# Altium project Data-Logging-Module.PrjPcb
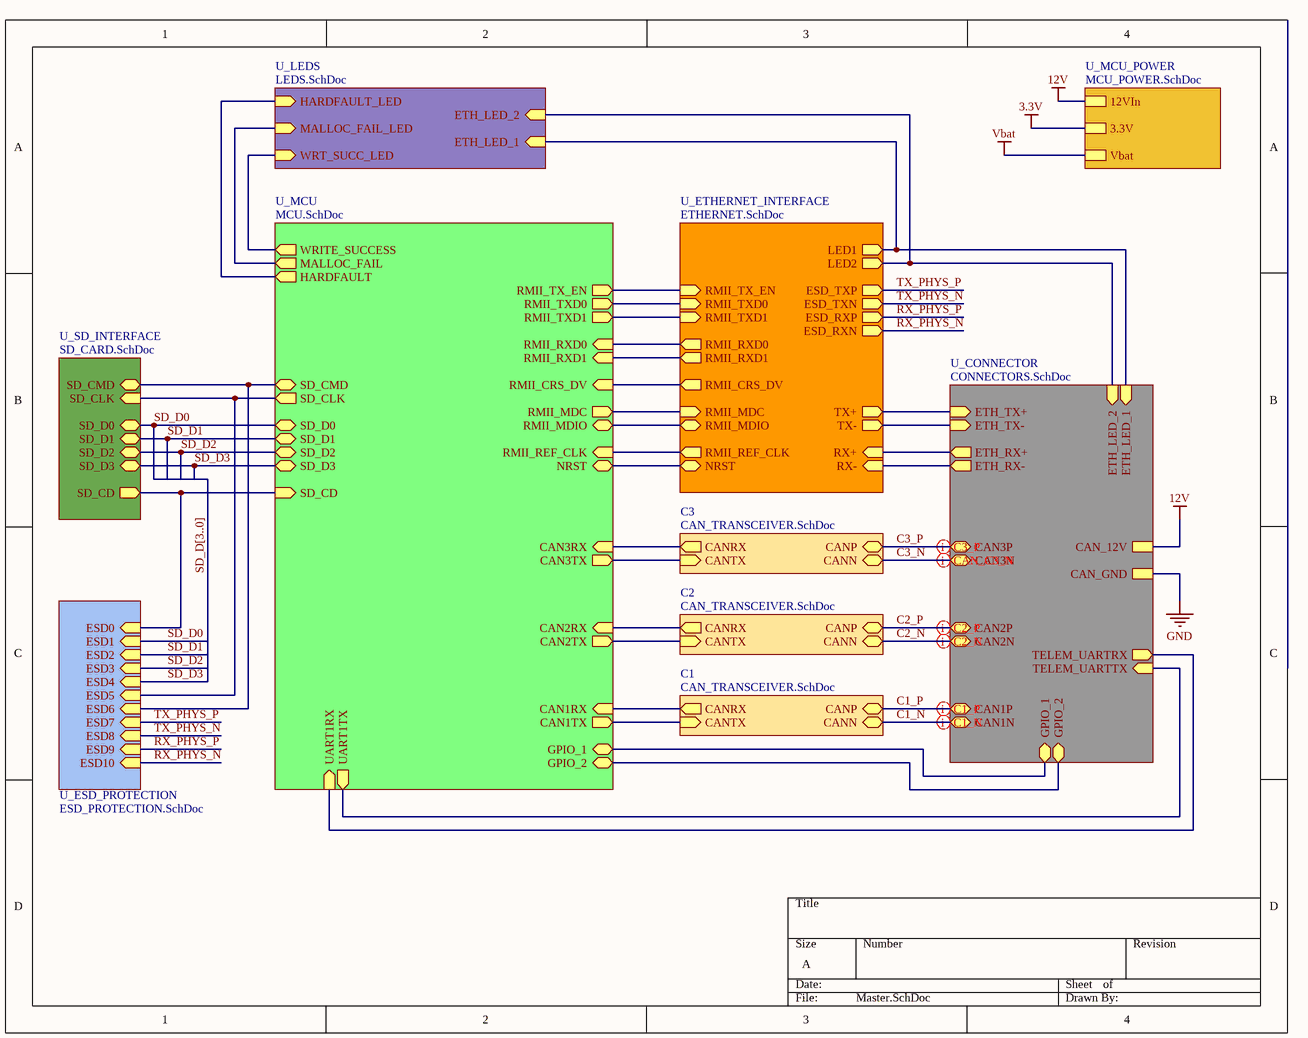
[diagram p0: Master.SchDoc]
9 sheets, 101 parts. Net scope: hierarchical (ports join the sheet entries above them; power ports are global).
Board file: ver1.PcbDoc
Sheets:
  Master.SchDoc
    U_MCU = MCU.SchDoc
    U_ETHERNET_INTERFACE = ETHERNET.SchDoc
    U_LEDS = LEDS.SchDoc
    U_MCU_POWER = MCU_POWER.SchDoc
    U_SD_INTERFACE = SD_CARD.SchDoc
    C3 = CAN_TRANSCEIVER.SchDoc
    C2 = CAN_TRANSCEIVER.SchDoc
    C1 = CAN_TRANSCEIVER.SchDoc
    U_CONNECTOR = CONNECTORS.SchDoc
    U_ESD_PROTECTION = ESD_PROTECTION.SchDoc

## Sheet Master.SchDoc
size A; SheetNumber: 1; SheetTotal: 9

### Sub-sheets
C1 = CAN_TRANSCEIVER.SchDoc: CANTX (in), CANP (bidir), CANN (bidir), CANRX (out)
C2 = CAN_TRANSCEIVER.SchDoc: CANTX (in), CANP (bidir), CANN (bidir), CANRX (out)
C3 = CAN_TRANSCEIVER.SchDoc: CANTX (in), CANP (bidir), CANN (bidir), CANRX (out)
U_CONNECTOR = CONNECTORS.SchDoc: ETH_TX+ (in), ETH_TX- (in), ETH_RX+ (out), ETH_RX- (out), CAN3P (bidir), CAN3N (bidir), CAN2P (bidir), CAN2N (bidir), CAN1P (bidir), CAN1N (bidir), TELEM_UARTTX (in), TELEM_UARTRX (out), CAN_12V, CAN_GND, ETH_LED_2 (in), ETH_LED_1 (in), GPIO_1 (bidir), GPIO_2 (bidir)
U_ESD_PROTECTION = ESD_PROTECTION.SchDoc: ESD0 (in), ESD1 (in), ESD2 (in), ESD3 (in), ESD4 (in), ESD5 (in), ESD6 (in), ESD7 (in), ESD8 (in), ESD9 (in), ESD10 (in)
U_ETHERNET_INTERFACE = ETHERNET.SchDoc: RMII_TX_EN (in), RMII_TXD0 (in), RMII_TXD1 (in), RMII_RXD0 (out), RMII_RXD1 (out), RMII_CRS_DV (out), RMII_MDC (in), RMII_MDIO (bidir), RMII_REF_CLK (out), TX+ (out), TX- (out), RX+ (in), RX- (in), LED1 (out), LED2 (out), NRST (bidir), ESD_TXP (out), ESD_TXN (out), ESD_RXP (out), ESD_RXN (out)
U_LEDS = LEDS.SchDoc: WRT_SUCC_LED (in), MALLOC_FAIL_LED (in), HARDFAULT_LED (in), ETH_LED_1 (in), ETH_LED_2 (in)
U_MCU = MCU.SchDoc: CAN1TX (out), CAN1RX (in), WRITE_SUCCESS (out), CAN2RX (in), CAN2TX (out), CAN3TX (out), CAN3RX (in), NRST (bidir), UART1TX (out), UART1RX (in), SD_CMD (bidir), SD_CLK (out), SD_D0 (bidir), SD_D1 (bidir), SD_D3 (bidir), SD_D2 (bidir), SD_CD (in), MALLOC_FAIL (out), HARDFAULT (out), RMII_TX_EN (out), RMII_TXD0 (out), RMII_TXD1 (out), RMII_RXD0 (in), RMII_RXD1 (in), RMII_CRS_DV (in), RMII_MDC (out), RMII_MDIO (bidir), RMII_REF_CLK (in), GPIO_1 (bidir), GPIO_2 (bidir)
U_MCU_POWER = MCU_POWER.SchDoc: 12VIn, 3.3V, Vbat
U_SD_INTERFACE = SD_CARD.SchDoc: SD_CMD (bidir), SD_CLK (in), SD_D0 (bidir), SD_D1 (bidir), SD_D2 (bidir), SD_D3 (bidir), SD_CD (out)

### Nets
12V: sheet U_MCU_POWER/12VIn, sheet U_CONNECTOR/CAN_12V
C1_N: sheet C1/CANN, sheet U_CONNECTOR/CAN1N
C1_P: sheet C1/CANP, sheet U_CONNECTOR/CAN1P
C2_N: sheet C2/CANN, sheet U_CONNECTOR/CAN2N
C2_P: sheet C2/CANP, sheet U_CONNECTOR/CAN2P
C3_N: sheet C3/CANN, sheet U_CONNECTOR/CAN3N
C3_P: sheet C3/CANP, sheet U_CONNECTOR/CAN3P
RX_N: sheet U_ETHERNET_INTERFACE/RX-, sheet U_CONNECTOR/ETH_RX-
RX_P: sheet U_ETHERNET_INTERFACE/RX+, sheet U_CONNECTOR/ETH_RX+
RX_PHYS_N: sheet U_ETHERNET_INTERFACE/ESD_RXN, sheet U_ESD_PROTECTION/ESD10
RX_PHYS_P: sheet U_ETHERNET_INTERFACE/ESD_RXP, sheet U_ESD_PROTECTION/ESD9
SD_D0: sheet U_MCU/SD_D0, sheet U_SD_INTERFACE/SD_D0, sheet U_ESD_PROTECTION/ESD1
SD_D1: sheet U_MCU/SD_D1, sheet U_SD_INTERFACE/SD_D1, sheet U_ESD_PROTECTION/ESD2
SD_D2: sheet U_MCU/SD_D2, sheet U_SD_INTERFACE/SD_D2, sheet U_ESD_PROTECTION/ESD3
SD_D3: sheet U_MCU/SD_D3, sheet U_SD_INTERFACE/SD_D3, sheet U_ESD_PROTECTION/ESD4
TX_N: sheet U_ETHERNET_INTERFACE/TX-, sheet U_CONNECTOR/ETH_TX-
TX_P: sheet U_ETHERNET_INTERFACE/TX+, sheet U_CONNECTOR/ETH_TX+
TX_PHYS_N: sheet U_ETHERNET_INTERFACE/ESD_TXN, sheet U_ESD_PROTECTION/ESD8
TX_PHYS_P: sheet U_ETHERNET_INTERFACE/ESD_TXP, sheet U_ESD_PROTECTION/ESD7
NetD3_2: sheet U_MCU/WRITE_SUCCESS, sheet U_LEDS/WRT_SUCC_LED
NetD4_2: sheet U_MCU/MALLOC_FAIL, sheet U_LEDS/MALLOC_FAIL_LED
NetD5_2: sheet U_MCU/HARDFAULT, sheet U_LEDS/HARDFAULT_LED
NetD6_2: sheet U_ETHERNET_INTERFACE/LED1, sheet U_LEDS/ETH_LED_1, sheet U_CONNECTOR/ETH_LED_1
NetD7_2: sheet U_ETHERNET_INTERFACE/LED2, sheet U_LEDS/ETH_LED_2, sheet U_CONNECTOR/ETH_LED_2
NetJ2_3: sheet U_MCU/SD_CMD, sheet U_SD_INTERFACE/SD_CMD, sheet U_ESD_PROTECTION/ESD6
NetJ2_5: sheet U_MCU/SD_CLK, sheet U_SD_INTERFACE/SD_CLK, sheet U_ESD_PROTECTION/ESD5
NetJ2_9: sheet U_MCU/SD_CD, sheet U_SD_INTERFACE/SD_CD, sheet U_ESD_PROTECTION/ESD0
NetP5_1: sheet U_MCU/UART1TX, sheet U_CONNECTOR/TELEM_UARTTX
NetP5_2: sheet U_MCU/UART1RX, sheet U_CONNECTOR/TELEM_UARTRX
NetP5_3: sheet U_MCU/GPIO_1, sheet U_CONNECTOR/GPIO_1
NetP5_4: sheet U_MCU/GPIO_2, sheet U_CONNECTOR/GPIO_2
NetP6_5: sheet U_MCU/NRST, sheet U_ETHERNET_INTERFACE/NRST
NetR14_2: sheet U_MCU/RMII_RXD0, sheet U_ETHERNET_INTERFACE/RMII_RXD0
NetR15_2: sheet U_MCU/RMII_RXD1, sheet U_ETHERNET_INTERFACE/RMII_RXD1
NetR19_2: sheet U_MCU/RMII_CRS_DV, sheet U_ETHERNET_INTERFACE/RMII_CRS_DV
NetR20_1: sheet U_MCU/RMII_REF_CLK, sheet U_ETHERNET_INTERFACE/RMII_REF_CLK
NetR22_2: sheet U_MCU/RMII_MDIO, sheet U_ETHERNET_INTERFACE/RMII_MDIO
NetU1_27: sheet U_MCU/RMII_MDC, sheet U_ETHERNET_INTERFACE/RMII_MDC
NetU1_74: sheet U_MCU/RMII_TXD1, sheet U_ETHERNET_INTERFACE/RMII_TXD1
NetU1_100: sheet U_MCU/CAN3TX, sheet C3/CANTX
NetU1_110: sheet U_MCU/CAN3RX, sheet C3/CANRX
NetU1_126: sheet U_MCU/RMII_TX_EN, sheet U_ETHERNET_INTERFACE/RMII_TX_EN
NetU1_128: sheet U_MCU/RMII_TXD0, sheet U_ETHERNET_INTERFACE/RMII_TXD0
NetU1_135: sheet U_MCU/CAN2RX, sheet C2/CANRX
NetU1_136: sheet U_MCU/CAN2TX, sheet C2/CANTX
NetU1_139: sheet U_MCU/CAN1RX, sheet C1/CANRX
NetU1_140: sheet U_MCU/CAN1TX, sheet C1/CANTX

### Buses and harness runs
bus SD_D[3..0]

### Layout directives
differential pair: C1_N, C1_P, C2_N, C2_P, C3_N, C3_P

## Sheet MCU.SchDoc
size A; SheetNumber: 2; SheetTotal: 9
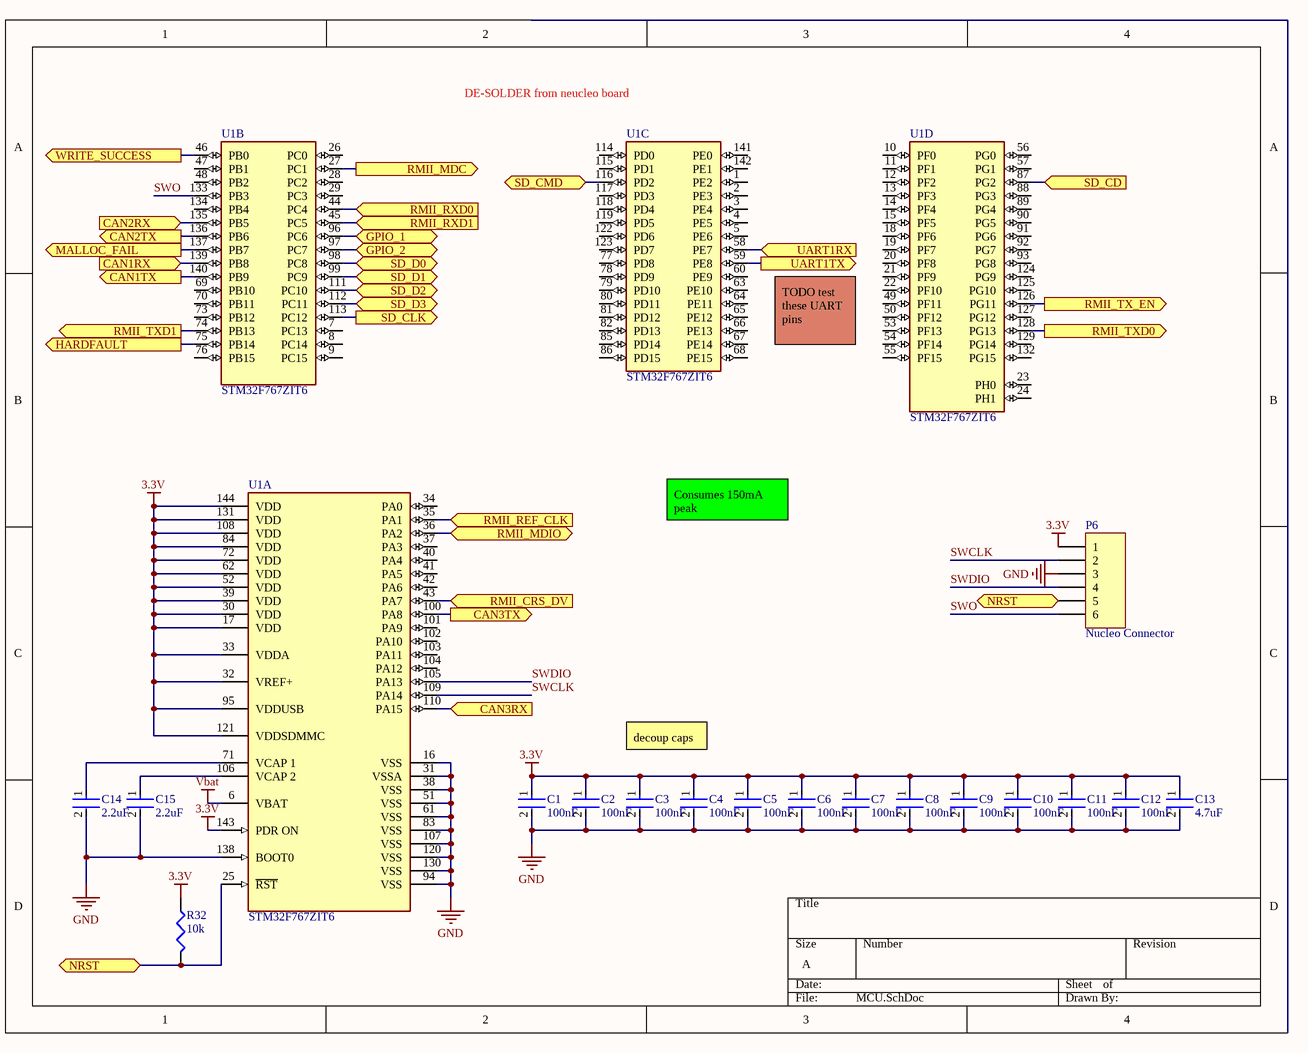
[diagram p1: MCU.SchDoc]

### Parts
C1  100nF  [FP-C0603C-CF-MFG]
C2  100nF  [FP-C0603C-CF-MFG]
C3  100nF  [FP-C0603C-CF-MFG]
C4  100nF  [FP-C0603C-CF-MFG]
C5  100nF  [FP-C0603C-CF-MFG]
C6  100nF  [FP-C0603C-CF-MFG]
C7  100nF  [FP-C0603C-CF-MFG]
C8  100nF  [FP-C0603C-CF-MFG]
C9  100nF  [FP-C0603C-CF-MFG]
C10  100nF  [FP-C0603C-CF-MFG]
C11  100nF  [FP-C0603C-CF-MFG]
C12  100nF  [FP-C0603C-CF-MFG]
C13  4.7uF  [FP-C0603C-CF-MFG]
C14  2.2uF  [FP-C0603C-CF-MFG]
C15  2.2uF  [FP-C0603C-CF-MFG]
P6  Nucleo Connector  [HDR1X6]
R32  10k  [J1-0603]
U1  STM32F767ZIT6  [FP-LQFP144-1A-MFG]  (parts A,B,C,D of 4)

### Ports
CAN1RX (in), CAN1TX (out), CAN2RX (in), CAN2TX (out), CAN3RX (in), CAN3TX (out), GPIO_1 (bidir), GPIO_2 (bidir), HARDFAULT (out), MALLOC_FAIL (out), NRST (bidir), RMII_CRS_DV (in), RMII_MDC (out), RMII_MDIO (bidir), RMII_REF_CLK (in), RMII_RXD0 (in), RMII_RXD1 (in), RMII_TX_EN (out), RMII_TXD0 (out), RMII_TXD1 (out), SD_CD (in), SD_CLK (out), SD_CMD (bidir), SD_D0 (bidir), SD_D1 (bidir), SD_D2 (bidir), SD_D3 (bidir), UART1RX (in), UART1TX (out), WRITE_SUCCESS (out)

### Nets
3.3V: C1.1 C2.1 C3.1 C4.1 C5.1 C6.1 C7.1 C8.1 C9.1 C10.1 C11.1 C12.1 C13.1 P6.1 R32.1 U1.17(VDD) U1.30(VDD) U1.32(VREF+) U1.33(VDDA) U1.39(VDD) U1.52(VDD) U1.62(VDD) U1.72(VDD) U1.84(VDD) U1.95(VDDUSB) U1.108(VDD) U1.121(VDDSDMMC) U1.131(VDD) U1.143(PDR_ON) U1.144(VDD)
GND: C1.2 C2.2 C3.2 C4.2 C5.2 C6.2 C7.2 C8.2 C9.2 C10.2 C11.2 C12.2 C13.2 C14.2 C15.2 P6.3 U1.16(VSS) U1.31(VSSA) U1.38(VSS) U1.51(VSS) U1.61(VSS) U1.83(VSS) U1.94(VSS) U1.107(VSS) U1.120(VSS) U1.130(VSS) U1.138(BOOT0)
Vbat: U1.6(VBAT)
SD_D0: U1.98(PC8) ; port SD_D0
SD_D1: U1.99(PC9) ; port SD_D1
SD_D2: U1.111(PC10) ; port SD_D2
SD_D3: U1.112(PC11) ; port SD_D3
SWCLK: P6.2 U1.109(PA14)
SWDIO: P6.4 U1.105(PA13)
SWO: P6.6 U1.133(PB3)
NetC14_1: C14.1 U1.71(VCAP_1)
NetC15_1: C15.1 U1.106(VCAP_2)
NetD3_2: U1.46(PB0) ; port WRITE_SUCCESS
NetD4_2: U1.137(PB7) ; port MALLOC_FAIL
NetD5_2: U1.75(PB14) ; port HARDFAULT
NetJ2_3: U1.116(PD2) ; port SD_CMD
NetJ2_5: U1.113(PC12) ; port SD_CLK
NetJ2_9: U1.87(PG2) ; port SD_CD
NetP5_1: U1.59(PE8) ; port UART1TX
NetP5_2: U1.58(PE7) ; port UART1RX
NetP5_3: U1.96(PC6) ; port GPIO_1
NetP5_4: U1.97(PC7) ; port GPIO_2
NetP6_5: P6.5 R32.2 U1.25(~{RST}) ; port NRST
NetR14_2: U1.44(PC4) ; port RMII_RXD0
NetR15_2: U1.45(PC5) ; port RMII_RXD1
NetR19_2: U1.43(PA7) ; port RMII_CRS_DV
NetR20_1: U1.35(PA1) ; port RMII_REF_CLK
NetR22_2: U1.36(PA2) ; port RMII_MDIO
NetU1_27: U1.27(PC1) ; port RMII_MDC
NetU1_74: U1.74(PB13) ; port RMII_TXD1
NetU1_100: U1.100(PA8) ; port CAN3TX
NetU1_110: U1.110(PA15) ; port CAN3RX
NetU1_126: U1.126(PG11) ; port RMII_TX_EN
NetU1_128: U1.128(PG13) ; port RMII_TXD0
NetU1_135: U1.135(PB5) ; port CAN2RX
NetU1_136: U1.136(PB6) ; port CAN2TX
NetU1_139: U1.139(PB8) ; port CAN1RX
NetU1_140: U1.140(PB9) ; port CAN1TX

Not connected (* = marked no-connect by the designer): U1 1(PE2) 2(PE3) 3(PE4) 4(PE5) 5(PE6) 7(PC13) 8(PC14) 9(PC15) 10(PF0) 11(PF1) 12(PF2) 13(PF3) 14(PF4) 15(PF5) 18(PF6) 19(PF7) 20(PF8) 21(PF9) 22(PF10) 23(PH0) 24(PH1) 26(PC0) 28(PC2) 29(PC3) 34(PA0) 37(PA3) 40(PA4) 41(PA5) 42(PA6) 47(PB1) 48(PB2) 49(PF11) 50(PF12) 53(PF13) 54(PF14) 55(PF15) 56(PG0) 57(PG1) 60(PE9) 63(PE10) 64(PE11) 65(PE12) 66(PE13) 67(PE14) 68(PE15) 69(PB10) 70(PB11) 73(PB12) 76(PB15) 77(PD8) 78(PD9) 79(PD10) 80(PD11) 81(PD12) 82(PD13) 85(PD14) 86(PD15) 88(PG3) 89(PG4) 90(PG5) 91(PG6) 92(PG7) 93(PG8) 101(PA9) 102(PA10) 103(PA11) 104(PA12) 114(PD0) 115(PD1) 117(PD3) 118(PD4) 119(PD5) 122(PD6) 123(PD7) 124(PG9) 125(PG10) 127(PG12) 129(PG14) 132(PG15) 134(PB4) 141(PE0) 142(PE1)

### Notes on the sheet
- DE-SOLDER from neucleo board
- TODO test these UART pins
- Consumes 150mA peak
- decoup caps

### Library data of the parts
C1-C15 = CMP-2006-03061-2: Any 0603 Cap is fine here; Manufacturer: KEMET; Manufacturer Part Number: C0603C104K5RACTU; Tolerance: 0.1; Temperature Coefficient: 30ppm/°C; Material: Ceramic; Automotive Grade: Grade 1; Voltage Rating: 50 V; Value: 0.10 μF; Temperature Characteristic: X7R; Temperature: -55°C to +125°C; RoHS: TRUE; Temperature Range High: +125°C; Lead Free: Yes; Octopart: https://octopart.com/c0603c104k5ractu-kemet-139244; Digikey Description: CAP CER 0.1UF 50V X7R 0603; Category: Cap; Package: C0603C-CF; ComponentLink2Description: Datasheet; Temperature Range Low: -55°C; Device Class L1: Passive Components; Automotive: Yes; Device Class L3: Ceramic Capacitors; ComponentLink2URL: https://api.kemet.com/component-edge/download/datasheet/C0603C100J5GACAUTO.pdf; Capacitance: 0.10 μF; Device Class L2: Capacitors; Height: 0.87mm
P6 = Header 6: Header, 6-Pin; LatestRevisionDate: 17-Jul-2002; LatestRevisionNote: Re-released for DXP Platform.; Publisher: Altium Limited
R32 = Res3: Resistor; Published: 8-Jun-2000; LatestRevisionDate: 29-May-2009; LatestRevisionNote: IPC-7351 Footprint Added.; PackageReference: J1-0603; Publisher: Altium Limited; PackageDescription: Chip Resistor; Value: 10K
U1 = CMP-12105-000074-1: IC MCU 32BIT 2MB FLASH 144LQFP; Manufacturer: STMicroelectronics; Ram Size: 512KBytes; Number Of I/Os: 114; Core Architecture: ARM Cortex-M7; Memory Size: 2048KBytes; Standoff Height: 0.05mm; Number Of Adc Channels: 24; Max Supply Voltage: 3.6V; Number Of Pwm Channels: 4; Min Supply Voltage: 1.7V; Max Junction Temp: +105°C; Number Of Timers/Counters: 15; Number Of Usb Channels: 1; Interface: I2C,SPI,UART,USART,EBI/EMI,CAN,USB,LIN,IrDA,Ethernet,I2S; Frequency: 216MHz; Data Bus Width: 32bits; Number Of Spi Channels: 6; Number Of A/D Converters: 3; Octopart: https://octopart.com/stm32f767zit6-stmicroelectronics-70527068; Category: IC; Device Class L2: Embedded Processors and Controllers; Package: LQFP144-1A; RoHS: TRUE; Digikey Description: IC MCU 32BIT 2MB FLASH 144LQFP; ComponentLink2Description: Datasheet; Automotive: No; Mouser Description: ARM Microcontrollers - MCU High-performance and DSP with FPU, ARM Cortex-M7 MCU with 2 Mbytes Flash, 216 MHz CPU, Art Accelerator, L1 cache, SDRAM,; Ambient Temperature Range Low: -40°C; Ambient Temperature Range High: +85°C; Memory Type: FLASH; ComponentLink2URL: https://www.st.com/resource/en/datasheet/stm32f767zi.pdf; Number Of Uart Channels: 4; Temperature: -40°C to +85°C; Device Class L3: Microcontrollers; Device Class L1: Integrated Circuits (ICs); Temperature Range Low: -40°C; Temperature Range High: +85°C; Lead Free: Yes; Number Of I2C Channels: 4; Number Of Ethernet Channels: 1; Height: 1.6mm; Number Of Cores: 1; Manufacturer Part Number: STM32F767ZIT6; Ipc Land Pattern Name: QFP50P2200X2200X160-144

## Sheet ETHERNET.SchDoc
size A; SheetNumber: 8; SheetTotal: 9
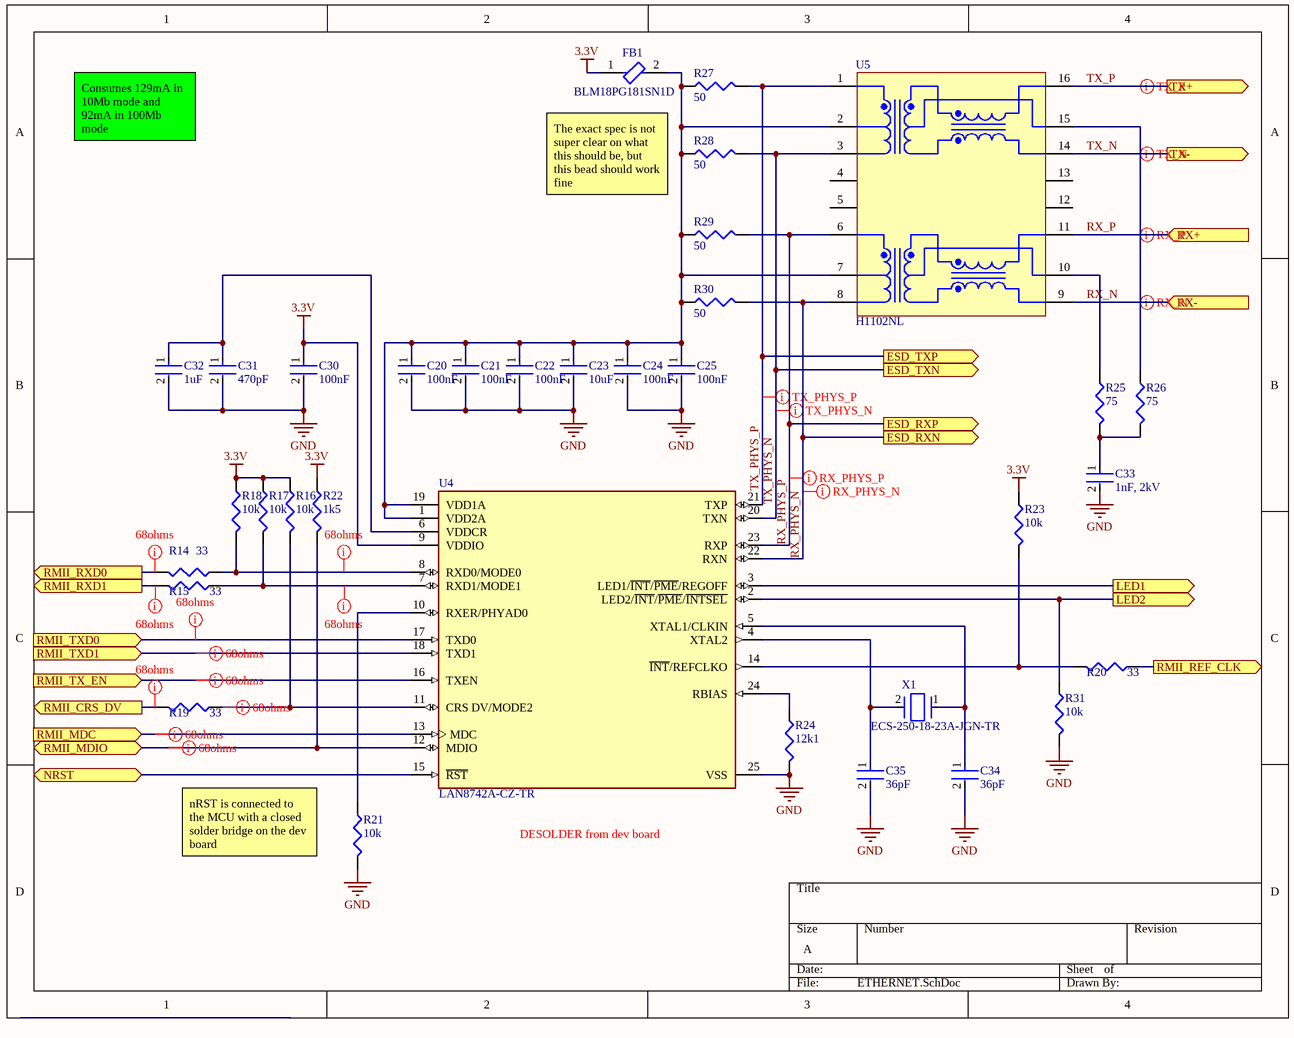
[diagram p2: ETHERNET.SchDoc]

### Parts
C20  100nF  [FP-C0603C-CF-MFG]
C21  100nF  [FP-C0603C-CF-MFG]
C22  100nF  [FP-C0603C-CF-MFG]
C23  10uF  [FP-C0603C-CF-MFG]
C24  100nF  [FP-C0603C-CF-MFG]
C25  100nF  [FP-C0603C-CF-MFG]
C30  100nF  [FP-C0603C-CF-MFG]
C31  470pF  [FP-C0603C-CF-MFG]
C32  1uF  [FP-C0603C-CF-MFG]
C33  1nF, 2kV  [FP-C0603C-CF-MFG]
C34  36pF  [FP-C0603C-CF-MFG]
C35  36pF  [FP-C0603C-CF-MFG]
FB1  BLM18PG181SN1D  [FP-BLM18-0_15-t0_8-IPC_B]
R14  33  [J1-0603]
R15  33  [J1-0603]
R16  10k  [J1-0603]
R17  10k  [J1-0603]
R18  10k  [J1-0603]
R19  33  [J1-0603]
R20  33  [J1-0603]
R21  10k  [J1-0603]
R22  1k5  [J1-0603]
R23  10k  [J1-0603]
R24  12k1  [J1-0603]
R25  75  [J1-0603]
R26  75  [J1-0603]
R27  50  [J1-0603]
R28  50  [J1-0603]
R29  50  [J1-0603]
R30  50  [J1-0603]
R31  10k  [J1-0603]
U4  LAN8742A-CZ-TR  [FP-C04-143B-S4QFN-MFG]
U5  H1102NL  [PULS-MODULE-16_V]
X1  ECS-250-18-23A-JGN-TR  [FP-ECX-64A-MFG]

### Ports
ESD_RXN (out), ESD_RXP (out), ESD_TXN (out), ESD_TXP (out), LED1 (out), LED2 (out), NRST (bidir), RMII_CRS_DV (out), RMII_MDC (in), RMII_MDIO (bidir), RMII_REF_CLK (out), RMII_RXD0 (out), RMII_RXD1 (out), RMII_TX_EN (in), RMII_TXD0 (in), RMII_TXD1 (in), RX+ (in), RX- (in), TX+ (out), TX- (out)

### Nets
3.3V: C30.1 FB1.1 R16.1 R17.1 R18.1 R22.1 R23.1 U4.9(VDDIO)
GND: C20.2 C21.2 C22.2 C23.2 C24.2 C25.2 C30.2 C31.2 C32.2 C33.2 C34.2 C35.2 R21.2 R24.2 R31.2 U4.25(VSS)
RX_N: U5.9 ; port RX-
RX_P: U5.11 ; port RX+
RX_PHYS_N: R30.2 U4.22(RXN) U5.8 ; port ESD_RXN
RX_PHYS_P: R29.2 U4.23(RXP) U5.6 ; port ESD_RXP
TX_N: U5.14 ; port TX-
TX_P: U5.16 ; port TX+
TX_PHYS_N: R28.2 U4.20(TXN) U5.3 ; port ESD_TXN
TX_PHYS_P: R27.2 U4.21(TXP) U5.1 ; port ESD_TXP
NetC20_1: C20.1 C21.1 C22.1 C23.1 C24.1 C25.1 FB1.2 R27.1 R28.1 R29.1 R30.1 U4.1(VDD2A) U4.19(VDD1A) U5.2 U5.7
NetC31_1: C31.1 C32.1 U4.6(VDDCR)
NetC33_1: C33.1 R25.2 R26.2
NetC34_1: C34.1 U4.5(XTAL1/CLKIN) X1.1(In/Out)
NetC35_1: C35.1 U4.4(XTAL2) X1.2(Out/In)
NetD6_2: U4.3(LED1/~{INT}/~{PME}/REGOFF) ; port LED1
NetD7_2: R31.1 U4.2(LED2/~{INT}/~{PME}/~{INTSEL}) ; port LED2
NetP6_5: U4.15(~{RST}) ; port NRST
NetR14_1: R14.1 R18.2 U4.8(RXD0/MODE0)
NetR14_2: R14.2 ; port RMII_RXD0
NetR15_1: R15.1 R17.2 U4.7(RXD1/MODE1)
NetR15_2: R15.2 ; port RMII_RXD1
NetR16_2: R16.2 R19.1 U4.11(CRS_DV/MODE2)
NetR19_2: R19.2 ; port RMII_CRS_DV
NetR20_1: R20.1 ; port RMII_REF_CLK
NetR20_2: R20.2 R23.2 U4.14(~{INT}/REFCLKO)
NetR21_1: R21.1 U4.10(RXER/PHYAD0)
NetR22_2: R22.2 U4.12(MDIO) ; port RMII_MDIO
NetR24_1: R24.1 U4.24(RBIAS)
NetR25_1: R25.1 U5.10
NetR26_1: R26.1 U5.15
NetU1_27: U4.13(MDC) ; port RMII_MDC
NetU1_74: U4.18(TXD1) ; port RMII_TXD1
NetU1_126: U4.16(TXEN) ; port RMII_TX_EN
NetU1_128: U4.17(TXD0) ; port RMII_TXD0

Not connected (* = marked no-connect by the designer): U5 4 5 12 13

### Layout directives
differential pair; differential pair class 100ohms: RX_N, RX_P, RX_PHYS_N, RX_PHYS_P, TX_N, TX_P, TX_PHYS_N, TX_PHYS_P
rule Impedance Constraint [Min = 67.00    Max = 69.00    ]; net class 68ohms: NetR14_1, NetR14_2, NetR15_1, NetR16_2, NetR19_2, NetU1_74, NetU1_126, NetU1_128
rule Impedance Constraint [Min = 67.00    Max = 69.00    ]: NetR15_2, NetR22_2, NetU1_27

### Notes on the sheet
- Consumes 129mA in 10Mb mode and 92mA in 100Mb mode
- The exact spec is not super clear on what this should be, but this bead should work fine
- DESOLDER from dev board
- (near R21) nRST is connected to the MCU with a closed solder bridge on the dev board

### Library data of the parts
C20-C25 C30-C35 = CMP-2006-03061-2: as C1 on sheet MCU; Temperature: -55°C to +125°C; RoHS: TRUE; Temperature Range High: +125°C; Lead Free: Yes; Octopart: https://octopart.com/c0603c104k5ractu-kemet-139244; Digikey Description: CAP CER 0.1UF 50V X7R 0603; Category: Cap; Package: C0603C-CF; ComponentLink2Description: Datasheet; Temperature Range Low: -55°C; Device Class L1: Passive Components; Automotive: Yes; Device Class L3: Ceramic Capacitors; ComponentLink2URL: https://api.kemet.com/component-edge/download/datasheet/C0603C100J5GACAUTO.pdf; Capacitance: 0.10 μF; Device Class L2: Capacitors; Height: 0.87mm
FB1 = CMP-0686-00566-4: Chip Ferrite Bead, 0603, 180Ω @ 100MHz, 0.09Ω, 25%, 1.5A; Number of Lines: 1; DC Resistance (DCR): 90mR; Shielding: Unshielded; Impedance: 180R; Depth: 0.8mm; Packaging: Tape and Reel; Width: 0.8mm; Current Rating: 1.5A; Min Operating Temperature: -55°C; Case Code (Metric): 1608; Case/Package: 0603; Max DC Current: 1.5A; Tolerance: 25%; Package Quantity: 1; Core Material: Ferrite; Number of Circuits: 1; Radiation Hardening: No; Height: 0.8mm; Max Operating Temperature: 125°C; Length: 1.6mm; Lead Free: Lead Free; REACH SVHC: No SVHC; Case Code (Imperial): 0603; Material: Ferrite; Max Current Rating: 1.5A; Termination: SMD/SMT; Number of Pins: 2; DC Current: 1.5A; Test Frequency: 100MHz
R14-R31 = Res3: Resistor; Published: 8-Jun-2000; LatestRevisionDate: 29-May-2009; LatestRevisionNote: IPC-7351 Footprint Added.; PackageReference: J1-0603; Publisher: Altium Limited; PackageDescription: Chip Resistor
  R14 R15 R19 R20: Value: 33
  R16-R18 R21 R23 R31: Value: 10K
  R22: Value: 1K5
  R24: Value: 12K1
  R25 R26: Value: 75
  R27-R30: Value: 50
U4 = CMP-06281-000006-2: IC TRANSCEIVER 1/1 24SQFN; Manufacturer: Microchip; Nominal Supply Current: 6.5-59mA; Max Supply Voltage: 3.6V; Number Of Channels: 1; Data Rate: 100Mbits/s; Interface: Ethernet,Other; Min Supply Voltage: 1.14V; Standoff Height: 0mm; Simplex Duplex: Full-Duplex; Rule: UNIONINDEX=0|RULEKIND=PlaneConnect|NETSCOPE=AnyNet|LAYERKIND=SameLayer|NAME=Schematic Power Plane Connect Style|PAD.PLANECONNECTSTYLE=Relief|PAD.RELIEFEXPANSION=20mil|PAD.RELIEFENTRIES=4|PAD.RELIEFCONDUCTORWIDTH=10mil|PAD.RELIEFAIRGAP=10mil|VIA.PLANECONNECTSTYLE=Direct|VIA.RELIEFEXPANSION=20mil|VIA.RELIEFENTRIES=4|VIA.RELIEFCONDUCTORWIDTH=10mil|VIA.RELIEFAIRGAP=10mil|UNIT=Imperial; Height: 1mm; Ambient Temperature Range High: +70°C; Category: IC; Mouser Description: Small Footprint RMII 10/100 Ethernet Transceiver with flexPWR Technology; Manufacturer Part Number: LAN8742A-CZ-TR; Digikey Description: IC TRANSCEIVER 1/1 24SQFN; Octopart: https://octopart.com/lan8742a-cz-tr-microchip-29030587; Temperature: 0°C to +70°C; Ambient Temperature Range Low: 0°C; Temperature Range Low: 0°C; ComponentLink2Description: Datasheet; Automotive: No; RoHS: TRUE; Device Class L3: Ethernet Interface ICs; Device Class L1: Integrated Circuits (ICs); Device Class L2: Interface ICs; Lead Free: Yes; Ipc Land Pattern Name: QFN50P400X400X90-24; ComponentLink2URL: http://ww1.microchip.com/downloads/en/DeviceDoc/DS_LAN8742_00001989A.pdf; Temperature Range High: +70°C; Package: C04-143B-S4QFN
U5 = CMP-2000-05322-1: 10/100 Base-T Single Port Surface Mount Magnetic with Turns Ratio, -40 to 85 degC, 16-Pin Module, RoHS, Tube; Manufacturer: Pulse; Unit Weight: 0.098767oz; Qualification: Commercial; Shielding: Unshielded; Isolation Voltage: 1.5kV; Frequency Range: 100kHzto100MHz; Width: 9.53m; Product Category: Audio&SignalTransformers; Number of Channels: Single; Package Reference: MODULE-16; Type: Module; Packaging: Tube; Application: 100Base-TX; Brand: Pulse; Datasheet URL: http://www.mouser.com/ds/2/336/H325-32121.pdf; Operating Temperature Range: 0Cto+70C; Termination Style: SMD/SMT; Product: LAN; Package Description: 16-Pin Surface Mount Device, Body 12.7 x 7.11 mm, Pitch 1.27 mm; Height: 6.09mm; Length: 12.7mm; Manufacturer URL: http://www.pulseelectronics.com/; Datasheet Version: Rev. H325.Q, 09/2009; RoHS: True
X1 = CMP-40224-000026-1: CRYSTAL 25.0000MHZ 18PF SMD; Frequency: 25MHz; Frequency Stability: 30ppm; Frequency Tolerance: 20ppm; ESR (Equivalent Series Resistance): 40R; Width: 0.138inch; Mount: Surface Mount; Load Capacitance: 18pF; Length: 0.236inch; Packaging: Cut Tape; Case/Package: SMD/SMT; Max Operating Temperature: 85°C; Height: 0.043inch; Min Operating Temperature: -40°C

## Sheet LEDS.SchDoc
size A; SheetNumber: 4; SheetTotal: 9
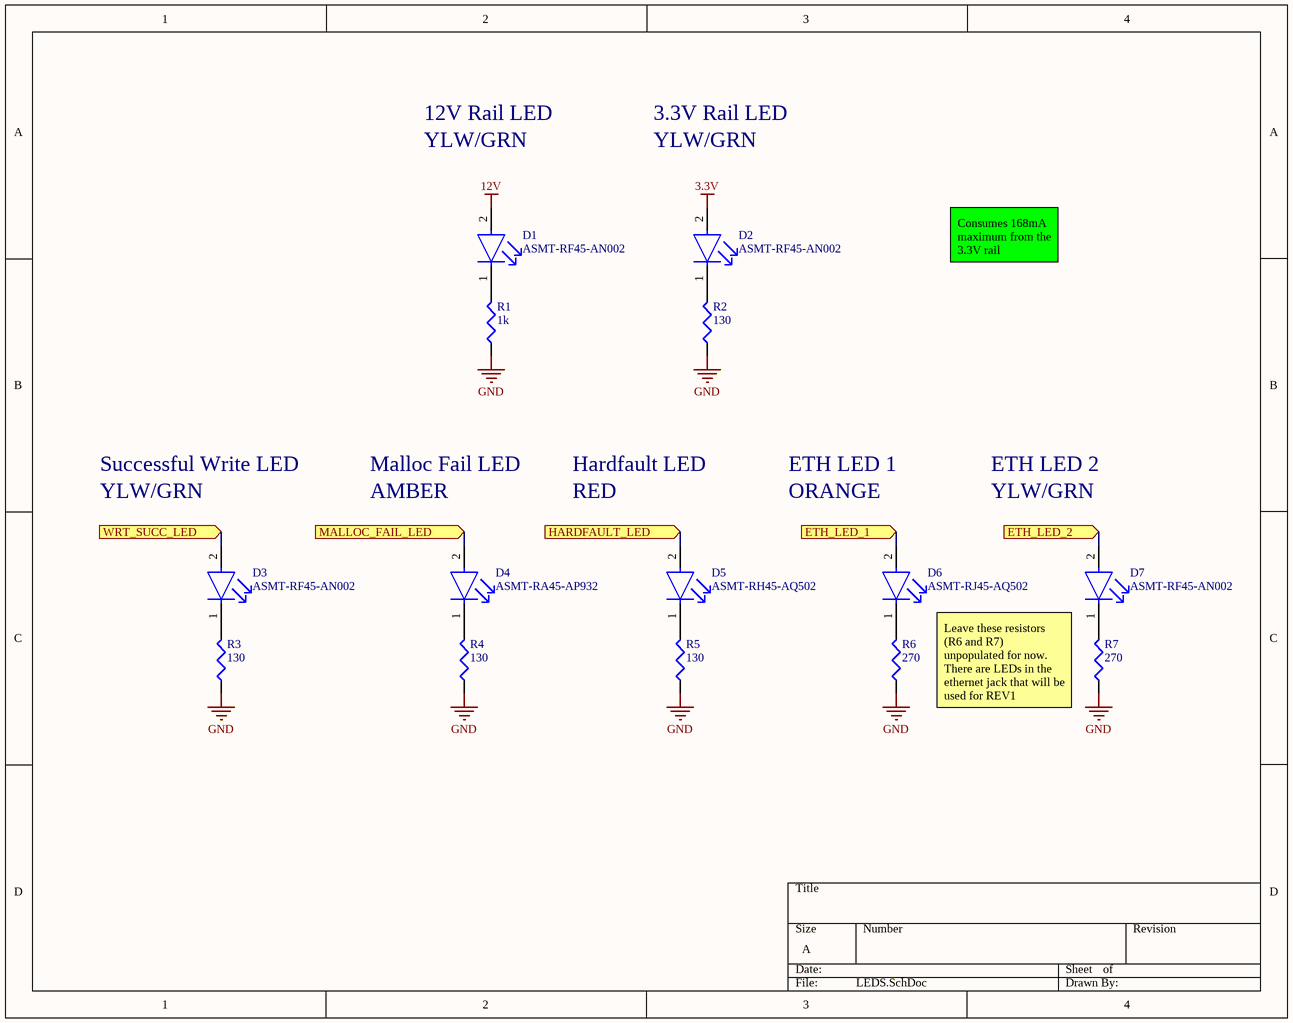
[diagram p3: LEDS.SchDoc]

### Parts
D1  ASMT-RF45-AN002  [FP-ASMT-RF45-AN002-MFG]
D2  ASMT-RF45-AN002  [FP-ASMT-RF45-AN002-MFG]
D3  ASMT-RF45-AN002  [FP-ASMT-RF45-AN002-MFG]
D4  ASMT-RA45-AP932  [FP-ASMT-RF45-AN002-MFG]
D5  ASMT-RH45-AQ502  [FP-ASMT-RF45-AN002-MFG]
D6  ASMT-RJ45-AQ502  [FP-ASMT-RF45-AN002-MFG]
D7  ASMT-RF45-AN002  [FP-ASMT-RF45-AN002-MFG]
R1  1k  [J1-0603]
R2  130  [J1-0603]
R3  130  [J1-0603]
R4  130  [J1-0603]
R5  130  [J1-0603]
R6  270  [J1-0603]
R7  270  [J1-0603]

### Ports
ETH_LED_1 (in), ETH_LED_2 (in), HARDFAULT_LED (in), MALLOC_FAIL_LED (in), WRT_SUCC_LED (in)

### Nets
3.3V: D2.2(A)
12V: D1.2(A)
GND: R1.1 R2.1 R3.1 R4.1 R5.1 R6.1 R7.1
NetD1_1: D1.1(C) R1.2
NetD2_1: D2.1(C) R2.2
NetD3_1: D3.1(C) R3.2
NetD3_2: D3.2(A) ; port WRT_SUCC_LED
NetD4_1: D4.1(C) R4.2
NetD4_2: D4.2(A) ; port MALLOC_FAIL_LED
NetD5_1: D5.1(C) R5.2
NetD5_2: D5.2(A) ; port HARDFAULT_LED
NetD6_1: D6.1(C) R6.2
NetD6_2: D6.2(A) ; port ETH_LED_1
NetD7_1: D7.1(C) R7.2
NetD7_2: D7.2(A) ; port ETH_LED_2

### Notes on the sheet
- 12V Rail LED
- YLW/GRN
- 3.3V Rail LED
- Consumes 168mA maximum from the 3.3V rail
- Successful Write LED
- Malloc Fail LED
- AMBER
- Hardfault LED
- RED
- ETH LED 1
- ORANGE
- ETH LED 2
- Leave these resistors (R6 and R7) unpopulated for now. There are LEDs in the ethernet jack that will be used for REV1

### Library data of the parts
D1-D3 D7 = CMP-2000-05796-2: LED YLW/GREEN DIFFUSED 0603 SMD; Manufacturer: Broadcom; Viewing Angle: 145°; Reverse Voltage: 5V; Luminous Intensity: 60mcd; Forward Voltage: 2V; Colour: Yellow Green; Wavelength: 573nm; Forward Current: 20mA; Led Orientation: Top View; Max Junction Temp: +110°C; Peak Emmision Wavelength: 574nm; Power Dissipation: 48mW; RoHS: TRUE; Category: Diode; Height: 0.55mm; Package: ASMT-RF45-AN002; Device Class L1: Optoelectronics; Temperature: -40°C to +100°C; ComponentLink2URL: https://docs.broadcom.com/docs/AV02-0378EN; Mouser Description: LED; SMD; 0603; yellow green; 28-60mcd; 1.6x0.8x0.45mm; 145°; 20mA; Temperature Range High: +100°C; Temperature Range Low: -40°C; Octopart: https://octopart.com/asmt-rf45-an002-broadcom-71127304; Lead Free: Yes; ComponentLink2Description: Datasheet; Device Class L2: LEDs; Manufacturer Part Number: ASMT-RF45-AN002; Digikey Description: LED YLW/GREEN DIFFUSED 0603 SMD; Automotive: No; Device Class L3: unset
D4 = CMP-2000-05796-2: LED AMBER DIFFUSED SMD; Manufacturer: Broadcom; Manufacturer Part Number: ASMT-RF45-AN002; Viewing Angle: 145°; Reverse Voltage: 5V; Luminous Intensity: 60mcd; Forward Voltage: 2V; Colour: Yellow Green; Wavelength: 573nm; Forward Current: 20mA; Led Orientation: Top View; Max Junction Temp: +110°C; Peak Emmision Wavelength: 574nm; Power Dissipation: 48mW; RoHS: TRUE; Category: Diode; Height: 0.55mm; Package: ASMT-RF45-AN002; Device Class L1: Optoelectronics; Temperature: -40°C to +100°C; ComponentLink2URL: https://docs.broadcom.com/docs/AV02-0378EN; Mouser Description: LED; SMD; 0603; yellow green; 28-60mcd; 1.6x0.8x0.45mm; 145°; 20mA; Temperature Range High: +100°C; Temperature Range Low: -40°C; Octopart: https://octopart.com/asmt-rf45-an002-broadcom-71127304; Lead Free: Yes; ComponentLink2Description: Datasheet; Device Class L2: LEDs; Digikey Description: LED YLW/GREEN DIFFUSED 0603 SMD; Automotive: No; Device Class L3: unset
D5 = CMP-2000-05796-2: LED RED DIFFUSED 0603 SMD; Manufacturer: Broadcom; Manufacturer Part Number: ASMT-RF45-AN002; Viewing Angle: 145°; Reverse Voltage: 5V; Luminous Intensity: 60mcd; Forward Voltage: 2V; Colour: Yellow Green; Wavelength: 573nm; Forward Current: 20mA; Led Orientation: Top View; Max Junction Temp: +110°C; Peak Emmision Wavelength: 574nm; Power Dissipation: 48mW; RoHS: TRUE; Category: Diode; Height: 0.55mm; Package: ASMT-RF45-AN002; Device Class L1: Optoelectronics; Temperature: -40°C to +100°C; ComponentLink2URL: https://docs.broadcom.com/docs/AV02-0378EN; Mouser Description: LED; SMD; 0603; yellow green; 28-60mcd; 1.6x0.8x0.45mm; 145°; 20mA; Temperature Range High: +100°C; Temperature Range Low: -40°C; Octopart: https://octopart.com/asmt-rf45-an002-broadcom-71127304; Lead Free: Yes; ComponentLink2Description: Datasheet; Device Class L2: LEDs; Digikey Description: LED YLW/GREEN DIFFUSED 0603 SMD; Automotive: No; Device Class L3: unset
D6 = CMP-2000-05796-2: LED ORANGE DIFFUSED 0603 SMD; Manufacturer: Broadcom; Manufacturer Part Number: ASMT-RF45-AN002; Viewing Angle: 145°; Reverse Voltage: 5V; Luminous Intensity: 60mcd; Forward Voltage: 2V; Colour: Yellow Green; Wavelength: 573nm; Forward Current: 20mA; Led Orientation: Top View; Max Junction Temp: +110°C; Peak Emmision Wavelength: 574nm; Power Dissipation: 48mW; RoHS: TRUE; Category: Diode; Height: 0.55mm; Package: ASMT-RF45-AN002; Device Class L1: Optoelectronics; Temperature: -40°C to +100°C; ComponentLink2URL: https://docs.broadcom.com/docs/AV02-0378EN; Mouser Description: LED; SMD; 0603; yellow green; 28-60mcd; 1.6x0.8x0.45mm; 145°; 20mA; Temperature Range High: +100°C; Temperature Range Low: -40°C; Octopart: https://octopart.com/asmt-rf45-an002-broadcom-71127304; Lead Free: Yes; ComponentLink2Description: Datasheet; Device Class L2: LEDs; Digikey Description: LED YLW/GREEN DIFFUSED 0603 SMD; Automotive: No; Device Class L3: unset
R1-R7 = Res3: Resistor; Published: 8-Jun-2000; LatestRevisionDate: 29-May-2009; LatestRevisionNote: IPC-7351 Footprint Added.; PackageReference: J1-0603; Publisher: Altium Limited; PackageDescription: Chip Resistor
  R1: Value: 1K
  R2-R5: Value: 130
  R6 R7: Value: 270

## Sheet MCU_POWER.SchDoc
size A; SheetNumber: 5; SheetTotal: 9
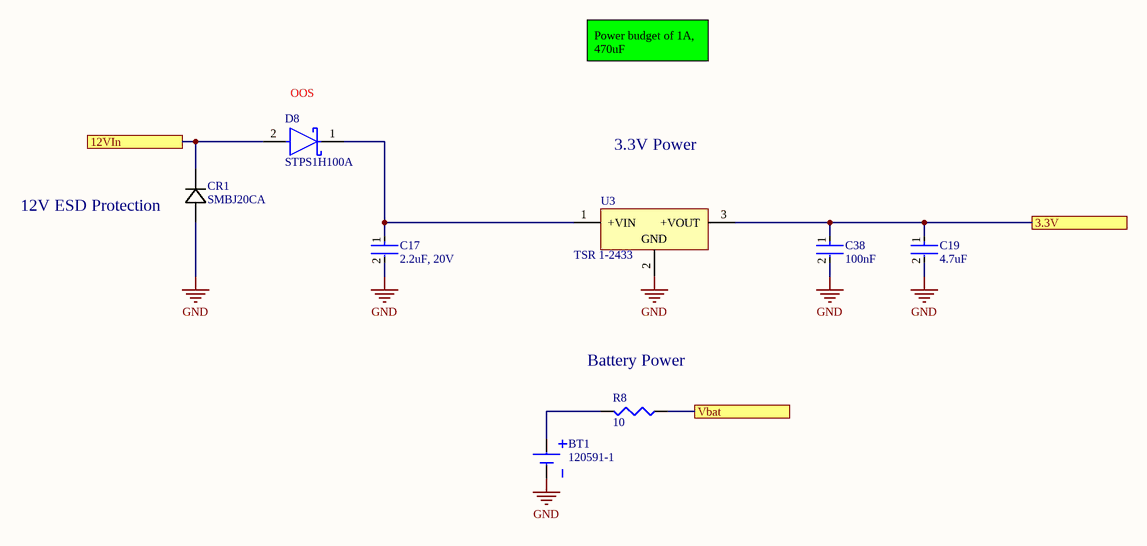
[diagram p4: MCU_POWER.SchDoc]

### Parts
BT1  120591-1  [TECO-120591-1-2_V]
C17  2.2uF, 20V  [FP-C0603C-CF-MFG]
C19  4.7uF  [FP-C0603C-CF-MFG]
C38  100nF  [FP-C0603C-CF-MFG]
CR1  SMBJ20CA  [SMB]
D8  STPS1H100A  [FP-SMA-MFG]
R8  10  [J1-0603]
U3  TSR 1-2433  [TRACO-SIP-3_V]

### Ports
3.3V, 12VIn, Vbat

### Nets
3.3V: C19.1 C38.1 U3.3(+VOUT) ; port 3.3V
12V: CR1.1 D8.2(A) ; port 12VIn
GND: BT1.2(-) C17.2 C19.2 C38.2 CR1.2 U3.2(GND)
Vbat: R8.1 ; port Vbat
NetBT1_1: BT1.1(+) R8.2
NetC17_1: C17.1 D8.1(K) U3.1(+VIN)

### Notes on the sheet
- (near D8) OOS
- Power budget of 1A, 470uF
- 3.3V Power
- (near CR1) 12V ESD Protection
- (near R8) Battery Power

### Library data of the parts
BT1 = CMP-0438-00001-2: Lithium Battery Holder for CR2032 3V Cell; Manufacturer: TE Connectivity; Packing Type: Tray; Body Shape: Horizontal Cylindrical; AccessRights: 2147483647; RevisionId: 1; Folder: Unified Components\Components\TE Connectivity\Connectors & Connector Components\Power Products\Battery Interconnection Products\; ContentType: Unified Component; ContentTypeGUID: CB3C11C4-E317-11DF-B822-12313F0024A2; ComponentLink1Description: Manufacturer URL; LifeCycleStateGUID: 61E382EE-6656-4F12-9E24-BE9327104A25; FolderGUID: A6761B51-D489-48A3-9180-F4808F45AB79; PartNumber: 120591-1; LifeCycle: Released; ReleaseDate: 20/08/2013 02:50:22 AM; PackageReference: 120591-1; ComponentLink2URL: http://www.te.com/commerce/DocumentDelivery/DDEController?Action=showdoc&DocId=Customer+Drawing%7F120591%7FH%7Fpdf%7FEnglish%7FENG_CD_120591_H.pdf%7F120591-1; DatasheetVersion: Rev. H, 01/2013; PackageDescription: Lithium Battery Holder; ItemGUID: B2C50140-681E-4F62-8DBB-9728605318CE; ItemHRID: CMP-0438-00001; Mounting Technology: Through Hole; ComponentLink1URL: http://www.te.com/; ComponentLink2Description: Datasheet
C17 C19 C38 = CMP-2006-03061-2: as C1 on sheet MCU; Temperature: -55°C to +125°C; RoHS: TRUE; Temperature Range High: +125°C; Lead Free: Yes; Octopart: https://octopart.com/c0603c104k5ractu-kemet-139244; Digikey Description: CAP CER 0.1UF 50V X7R 0603; Category: Cap; Package: C0603C-CF; ComponentLink2Description: Datasheet; Temperature Range Low: -55°C; Device Class L1: Passive Components; Automotive: Yes; Device Class L3: Ceramic Capacitors; ComponentLink2URL: https://api.kemet.com/component-edge/download/datasheet/C0603C100J5GACAUTO.pdf; Capacitance: 0.10 μF; Device Class L2: Capacitors; Height: 0.87mm
CR1 = SMBJ20CA: Imported; Vendor: Bourns Electronics; Built_By: EMA_UL_Team; Type: DEV; C: Copyright (C) 2015 Accelerated Designs. All rights reserved; Manufacturer_Part_Number: SMBJ20CA; RefDes: RefDes; Value: Value; Part Number: SMBJ20CA
D8 = CMP-2000-07173-2: DIODE SCHOTTKY 100V 1A SMA; Manufacturer: STMicroelectronics; Standoff Height: 0.05mm; Peak Reverse Current: 4uA; Max Junction Temp: +175°C; Max Surge Forward Current: 50A; Temperature Range High: +175°C; Device Class L3: Schottky Diodes; Height: 2.65mm; Manufacturer Part Number: STPS1H100A; ComponentLink2URL: https://www.st.com/resource/en/datasheet/stps1h100.pdf; Category: Diode; RoHS: TRUE; Automotive: No; Digikey Description: DIODE SCHOTTKY 100V 1A SMA; Mouser Description: Schottky Diodes & Rectifiers 1.0 Amp 100 Volt; Device Class L2: Diodes; ComponentLink2Description: Datasheet; Forward Current: 1A; Package: SMA; Octopart: https://octopart.com/stps1h100a-stmicroelectronics-55399361; Temperature: to +175°C; Max Repetitive Reverse Voltage: 100V; Lead Free: Yes; Device Class L1: Discrete Semiconductors
R8 = Res3: Resistor; Published: 8-Jun-2000; LatestRevisionDate: 29-May-2009; LatestRevisionNote: IPC-7351 Footprint Added.; PackageReference: J1-0603; Publisher: Altium Limited; PackageDescription: Chip Resistor; Value: 10
U3 = CMP-2000-05426-1: DC/DC Converter, TSR-1 Series, 3.3 VDC, 1 A, -40 to 85 degC, 3-Pin THD (SIP), RoHS; Manufacturer: Tracopower; No. of Outputs: 1Output; SVHC: NoSVHC(17-Dec-2015); Input Voltage DC Max: 36V; Input Voltage DC Min: 4.75V; DC / DC Converter Output Type: Fixed; Output Voltage Nom.: 3.3V; Output Current Max: 1A; DC / DC Converter Mounting: ThroughHole; Output Power Max: 3.3W; Datasheet URL: https://datasheet.ciiva.com/6815/tsr1-6815641.pdf; Package Reference: SIP-3; Depth: 11.5mm; Manufacturer URL: http://www.tracopower.com/home; Approvals & Standards: -; Width: 7.6mm; Package Description: 3-Pin Single In-line Package, Body 11.7 x 7.6 mm, Pitch 2.54 mm; Product Range: TSR-1Series; DC / DC Converter Type: SIP; Datasheet Version: Jan-15; Height: 10.2mm

## Sheet SD_CARD.SchDoc
size A; SheetNumber: 7; SheetTotal: 9
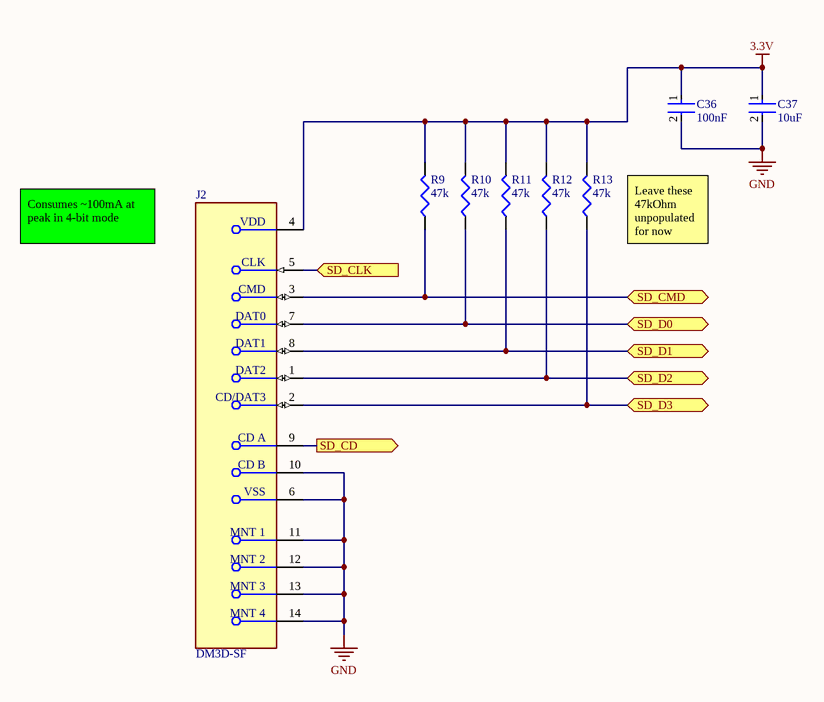
[diagram p5: SD_CARD.SchDoc]

### Parts
C36  100nF  [FP-C0603C-CF-MFG]
C37  10uF  [FP-C0603C-CF-MFG]
J2  DM3D-SF  [FP-DM3D-SF-MFG]
R9  47k  [J1-0603]
R10  47k  [J1-0603]
R11  47k  [J1-0603]
R12  47k  [J1-0603]
R13  47k  [J1-0603]

### Ports
SD_CD (out), SD_CLK (in), SD_CMD (bidir), SD_D0 (bidir), SD_D1 (bidir), SD_D2 (bidir), SD_D3 (bidir)

### Nets
3.3V: C36.1 C37.1 J2.4(VDD) R9.2 R10.2 R11.2 R12.2 R13.2
GND: C36.2 C37.2 J2.6(VSS) J2.10(CD_B) J2.11(MNT_1) J2.12(MNT_2) J2.13(MNT_3) J2.14(MNT_4)
SD_D0: J2.7(DAT0) R10.1 ; port SD_D0
SD_D1: J2.8(DAT1) R11.1 ; port SD_D1
SD_D2: J2.1(DAT2) R12.1 ; port SD_D2
SD_D3: J2.2(CD/DAT3) R13.1 ; port SD_D3
NetJ2_3: J2.3(CMD) R9.1 ; port SD_CMD
NetJ2_5: J2.5(CLK) ; port SD_CLK
NetJ2_9: J2.9(CD_A) ; port SD_CD

### Notes on the sheet
- Consumes ~100mA at peak in 4-bit mode
- Leave these 47kOhm unpopulated for now

### Library data of the parts
C36 C37 = CMP-2006-03061-2: as C1 on sheet MCU; Temperature: -55°C to +125°C; RoHS: TRUE; Temperature Range High: +125°C; Lead Free: Yes; Octopart: https://octopart.com/c0603c104k5ractu-kemet-139244; Digikey Description: CAP CER 0.1UF 50V X7R 0603; Category: Cap; Package: C0603C-CF; ComponentLink2Description: Datasheet; Temperature Range Low: -55°C; Device Class L1: Passive Components; Automotive: Yes; Device Class L3: Ceramic Capacitors; ComponentLink2URL: https://api.kemet.com/component-edge/download/datasheet/C0603C100J5GACAUTO.pdf; Capacitance: 0.10 μF; Device Class L2: Capacitors; Height: 0.87mm
J2 = CMP-2000-06166-2: CONN MICRO SD CARD PUSH-PULL; Insulation Resistance: 1GR; Max Voltage Rating (AC): 125V; Gender: Female; Contact Resistance: 100mR; Current Rating: 500mA; Pitch: 1.1mm; Connector Type: Connector; Number of Contacts: 8; Contact Plating: Gold; Number of Rows: 1; Termination: Solder; Contact Material: Copper Alloy; REACH SVHC: No SVHC; Voltage Rating (AC): 125V; Packaging: Tape and Reel; Housing Material: Polymer; Max Operating Temperature: 85°C; Package Quantity: 1; Min Operating Temperature: -25°C; Lead Free: Lead Free; Orientation: Right Angle; Radiation Hardening: No; Flammability Rating: UL94 V-0; Mount: Surface Mount; Depth: 11.45mm; Max Current Rating: 500mA; Length: 11.95mm; Width: 11.95mm
R9-R13 = Res3: Resistor; Published: 8-Jun-2000; LatestRevisionDate: 29-May-2009; LatestRevisionNote: IPC-7351 Footprint Added.; PackageReference: J1-0603; Publisher: Altium Limited; PackageDescription: Chip Resistor; Value: 47K

## Sheet CAN_TRANSCEIVER.SchDoc
size A; SheetNumber: 3; SheetTotal: 9
Used 3 times, as channels C3, C2, C1. Parts and nets are listed once, with the designators drawn on the sheet.
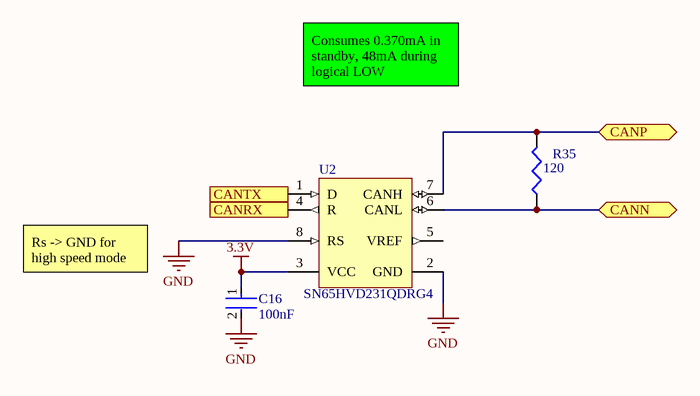
[diagram p6: CAN_TRANSCEIVER.SchDoc]

### Parts
C16  100nF  [FP-C0603C-CF-MFG]
R35  120  [J1-0603]
U2  SN65HVD231QDRG4  [D0008A_N]

### Ports
CANN (bidir), CANP (bidir), CANRX (out), CANTX (in)

### Nets
3.3V: C16.1 U2.3(VCC)
GND: C16.2 U2.2(GND) U2.8(RS)
CANN: R35.1 U2.6(CANL) ; port CANN
CANP: R35.2 U2.7(CANH) ; port CANP
CANRX: U2.4(R) ; port CANRX
CANTX: U2.1(D) ; port CANTX

Not connected (* = marked no-connect by the designer): U2 5(VREF)

### Channels
C3: designators end in _C3; ports CANN=C3_N CANP=C3_P CANRX=NetU1_110 CANTX=NetU1_100
C2: designators end in _C2; ports CANN=C2_N CANP=C2_P CANRX=NetU1_135 CANTX=NetU1_136
C1: designators end in _C1; ports CANN=C1_N CANP=C1_P CANRX=NetU1_139 CANTX=NetU1_140

### Notes on the sheet
- Consumes 0.370mA in standby, 48mA during logical LOW
- Rs -> GND for high speed mode

### Library data of the parts
C16 = CMP-2006-03061-2: as C1 on sheet MCU; Temperature: -55°C to +125°C; RoHS: TRUE; Temperature Range High: +125°C; Lead Free: Yes; Octopart: https://octopart.com/c0603c104k5ractu-kemet-139244; Digikey Description: CAP CER 0.1UF 50V X7R 0603; Category: Cap; Package: C0603C-CF; ComponentLink2Description: Datasheet; Temperature Range Low: -55°C; Device Class L1: Passive Components; Automotive: Yes; Device Class L3: Ceramic Capacitors; ComponentLink2URL: https://api.kemet.com/component-edge/download/datasheet/C0603C100J5GACAUTO.pdf; Capacitance: 0.10 μF; Device Class L2: Capacitors; Height: 0.87mm
R35 = Res3: Resistor; Published: 8-Jun-2000; LatestRevisionDate: 29-May-2009; LatestRevisionNote: IPC-7351 Footprint Added.; PackageReference: J1-0603; Publisher: Altium Limited; PackageDescription: Chip Resistor; Value: 120
U2 = CMP-0315-00044-2: Automotive Catalog CAN Transceiver, 17 mA, 3.3 V, -40 to 125 degC, 8-pin SOIC (D), Green (RoHS & no Sb/Br); PartNumber: SN65HVD231QDRQ1; Manufacturer: Texas Instruments; ICC(Max)(mA): 17; Supply Voltage(s)(V): 3.3; Receivers Per Package: 1; Transient Pulse Protection(V): -25 to 25; ComponentLink1URL: http://www.ti.com/general/docs/lit/getliterature.tsp?genericPartNumber=SN65HVD231Q-Q1&fileType=pdf; Code_JEDEC: MS-012AA; Eco-Plan: Green (RoHS & no Sb/Br); DatasheetVersion: SGLS398A; PackageReference: D0008A; ComponentLink1Description: Datasheet; SubFamily: CAN; PackageVersion: revM, Jun-2011; Rating: Automotive; Mounting Technology: Surface Mount; Footprint: PCA82C250; Drivers Per Package: 1; PackageDescription: 8-Pin Plastic Small Outline Integrated Circuit, 4.9 x 3.9 mm, Pitch 1.27 mm Pitch; Isolated: No

## Sheet CONNECTORS.SchDoc
size A; SheetNumber: 6; SheetTotal: 9
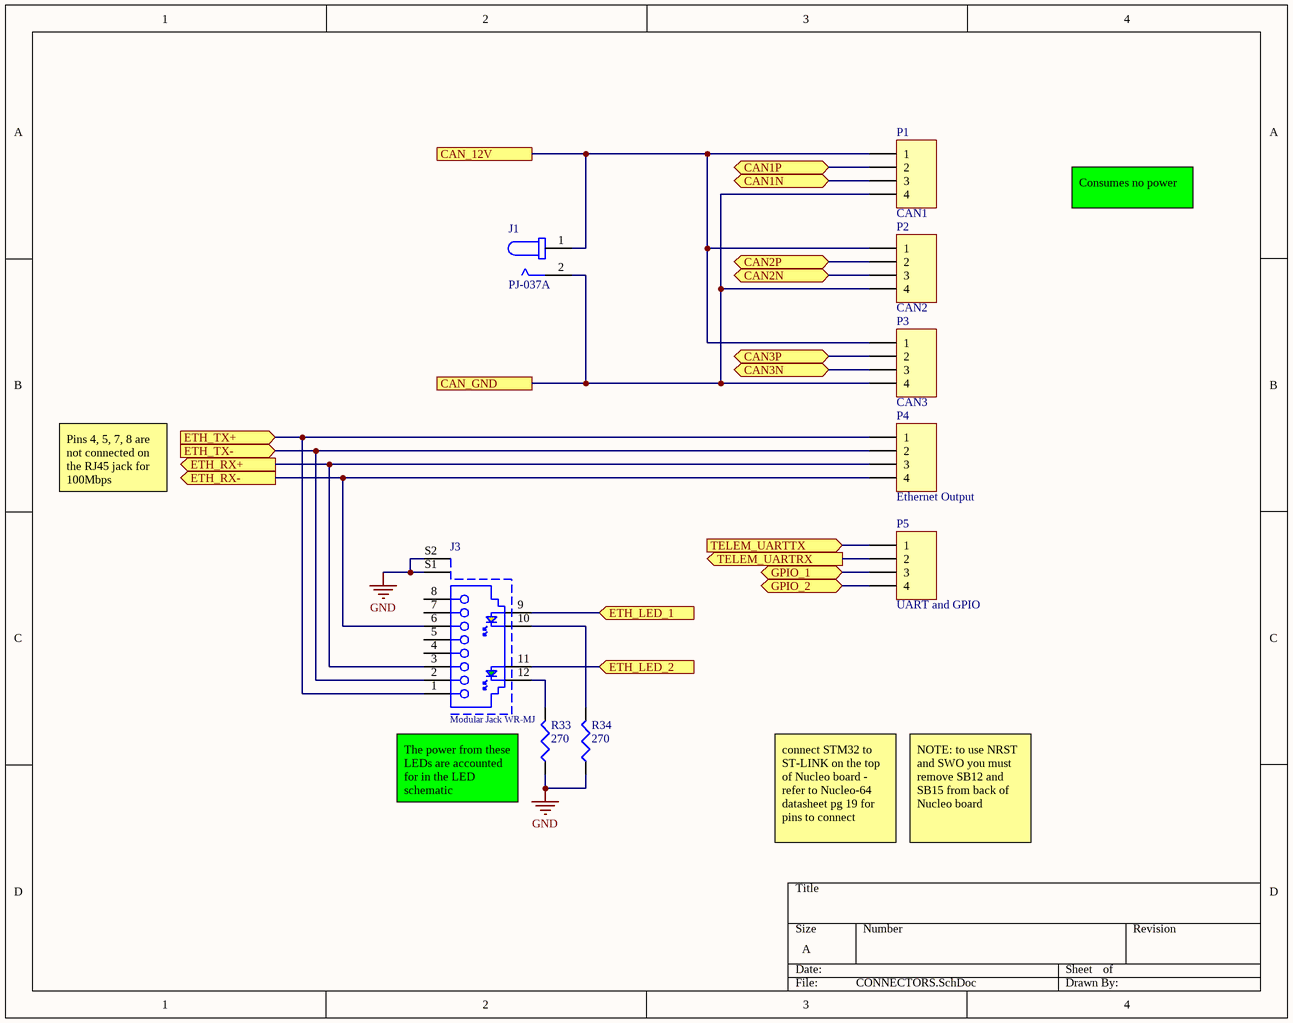
[diagram p7: CONNECTORS.SchDoc]

### Parts
J1  PJ-037A  [CUI_PJ-037A]
J3  Modular Jack WR-MJ  [615008137421]
P1  CAN1  [HDR1X4]
P2  CAN2  [HDR1X4]
P3  CAN3  [HDR1X4]
P4  Ethernet Output  [HDR1X4]
P5  UART and GPIO  [HDR1X4]
R33  270  [J1-0603]
R34  270  [J1-0603]

### Ports
CAN1N (bidir), CAN1P (bidir), CAN2N (bidir), CAN2P (bidir), CAN3N (bidir), CAN3P (bidir), CAN_12V, CAN_GND, ETH_LED_1 (in), ETH_LED_2 (in), ETH_RX+ (out), ETH_RX- (out), ETH_TX+ (in), ETH_TX- (in), GPIO_1 (bidir), GPIO_2 (bidir), TELEM_UARTRX (out), TELEM_UARTTX (in)

### Nets
12V: J1.1 P1.1 P2.1 P3.1 ; port CAN_12V
GND: J1.2 J3.S1 J3.S2 P1.4 P2.4 P3.4 R33.1 R34.1 ; port CAN_GND
C1_N: P1.3 ; port CAN1N
C1_P: P1.2 ; port CAN1P
C2_N: P2.3 ; port CAN2N
C2_P: P2.2 ; port CAN2P
C3_N: P3.3 ; port CAN3N
C3_P: P3.2 ; port CAN3P
RX_N: J3.6 P4.4 ; port ETH_RX-
RX_P: J3.3 P4.3 ; port ETH_RX+
TX_N: J3.2 P4.2 ; port ETH_TX-
TX_P: J3.1 P4.1 ; port ETH_TX+
NetD6_2: J3.9 ; port ETH_LED_1
NetD7_2: J3.11 ; port ETH_LED_2
NetJ3_10: J3.10 R34.2
NetJ3_12: J3.12 R33.2
NetP5_1: P5.1 ; port TELEM_UARTTX
NetP5_2: P5.2 ; port TELEM_UARTRX
NetP5_3: P5.3 ; port GPIO_1
NetP5_4: P5.4 ; port GPIO_2

Not connected (* = marked no-connect by the designer): J3 4 5 7 8

### Notes on the sheet
- Consumes no power
- Pins 4, 5, 7, 8 are not connected on the RJ45 jack for 100Mbps
- The power from these LEDs are accounted for in the LED schematic
- connect STM32 to ST-LINK on the top of Nucleo board - refer to Nucleo-64 datasheet pg 19 for pins to connect
- NOTE: to use NRST and SWO you must remove SB12 and SB15 from back of Nucleo board

### Library data of the parts
J1 = PJ-037A: 2.0 x 6.5 mm, 2.5 A, Horizontal, Through Hole, Dc Power Jack Connector / VEL12US120-US-JA is a good power source; MF: CUI Devices; Price: None; Package: None; MP: PJ-037A; Value: *; Availability: Unavailable; SnapEDA_Link: https://www.snapeda.com/parts/PJ-037A/CUI%20Devices/view-part/493699/?ref=snap; CUI_purchase_URL: https://www.cuidevices.com/product/interconnect/connectors/dc-power-connectors/jacks/pj-037a?utm_source=snapeda.com&utm_medium=referral&utm_campaign=snapedaBOM
J3 = CMP-1502-01697-1: Modular Jack WR-MJ, Tab Up, Shielded, with LED and EMI Panel Finger, Horizontal Entry, THT, 8P8C; Manufacturer: Wurth Elektronik; Compliance: Leadfree/RoHS; Withstanding Voltage: 1000VAC; Port: 1x1; Contact Resistance: 20mOhm; Rated Current: 1.5A; Working Voltage: 120VAC; Manufacturer URL: http://www.we-online.de; Mounting Technology: THT; Entrance: Horizontal; Datasheet URL: https://katalog.we-online.de/em/datasheet/615008137421.pdf; Packaging: Tray; Package Reference: 615008137421; Publisher: WurthElektronik; Operating Temperature: -40to85degC; Part Number: 615008137421; Pin Number: 8P8C
P1-P5 = Header 4: Header, 4-Pin; LatestRevisionDate: 17-Jul-2002; LatestRevisionNote: Re-released for DXP Platform.; Publisher: Altium Limited
R33 R34 = Res3: Resistor; Published: 8-Jun-2000; LatestRevisionDate: 29-May-2009; LatestRevisionNote: IPC-7351 Footprint Added.; PackageReference: J1-0603; Publisher: Altium Limited; PackageDescription: Chip Resistor; Value: 270

## Sheet ESD_PROTECTION.SchDoc
size A; SheetNumber: 9; SheetTotal: 9
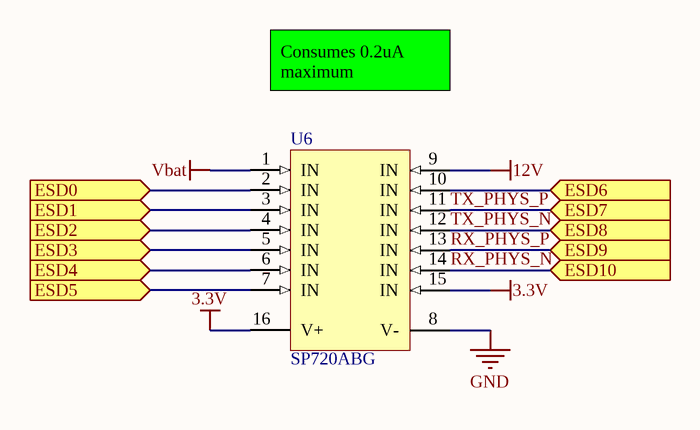
[diagram p8: ESD_PROTECTION.SchDoc]

### Parts
U6  SP720ABG  [LFUS-SOIC-16_L]

### Ports
ESD0 (in), ESD1 (in), ESD2 (in), ESD3 (in), ESD4 (in), ESD5 (in), ESD6 (in), ESD7 (in), ESD8 (in), ESD9 (in), ESD10 (in)

### Nets
3.3V: U6.15(IN) U6.16(V+)
12V: U6.9(IN)
GND: U6.8(V-)
Vbat: U6.1(IN)
RX_PHYS_N: U6.14(IN) ; port ESD10
RX_PHYS_P: U6.13(IN) ; port ESD9
SD_D0: U6.3(IN) ; port ESD1
SD_D1: U6.4(IN) ; port ESD2
SD_D2: U6.5(IN) ; port ESD3
SD_D3: U6.6(IN) ; port ESD4
TX_PHYS_N: U6.12(IN) ; port ESD8
TX_PHYS_P: U6.11(IN) ; port ESD7
NetJ2_3: U6.10(IN) ; port ESD6
NetJ2_5: U6.7(IN) ; port ESD5
NetJ2_9: U6.2(IN) ; port ESD0

### Notes on the sheet
- Consumes 0.2uA maximum

### Library data of the parts
U6 = CMP-2000-07137-1: Electronic Protection Array for ESD and Overvoltage Protection, 3 pF, -40 to 105 degC, 16-Pin SOIC, RoHS, Tube; Manufacturer: Littelfuse; Other Names: F2717; Online Catalog: SPA™SP72xSeries; Voltage - Working: 30V; Product Training Modules: TVSDiodeArrays-ESDSuppressorsforI/OInterfaces; Number of Circuits: 14; Catalog Drawings: SP72SeriesCircuit; Datasheet URL: https://datasheet.ciiva.com/1219/sp720-leadfree-1219859.pdf; Standard Package: 1,920; Technology: MixedTechnology; Package Description: 16-Pin Small Outline Integrated Circuit, Body 9.9 x 3.9 mm, Pitch 1.27 mm; Family: TVS-MixedTechnology; Applications: GeneralPurpose; Datasheet Version: 01/2006; Package / Case: 16-SOIC(0.154",3.90mmWidth); Manufacturer URL: http://www.littelfuse.com/; Series: -; Voltage - Clamping: -; Supplier Device Package: 16-SOIC; Mounting Technology: SurfaceMount; Power (Watts): -; Category: CircuitProtection; Package Reference: SOIC-16; Packaging: Tube

## Nets that join several sheets
3.3V: MCU (30 pins), ETHERNET (8 pins), LEDS (D2.2), MCU_POWER (C19.1 C38.1 U3.3), SD_CARD (8 pins), C3 (C16_C3.1 U2_C3.3), C2 (C16_C2.1 U2_C2.3), C1 (C16_C1.1 U2_C1.3), ESD_PROTECTION (U6.15 U6.16)
12V: LEDS (D1.2), MCU_POWER (CR1.1 D8.2), CONNECTORS (J1.1 P1.1 P2.1 P3.1), ESD_PROTECTION (U6.9)
GND: MCU (27 pins), ETHERNET (16 pins), LEDS (7 pins), MCU_POWER (6 pins), SD_CARD (8 pins), C3 (C16_C3.2 U2_C3.2 U2_C3.8), C2 (C16_C2.2 U2_C2.2 U2_C2.8), C1 (C16_C1.2 U2_C1.2 U2_C1.8), CONNECTORS (8 pins), ESD_PROTECTION (U6.8)
Vbat: MCU (U1.6), MCU_POWER (R8.1), ESD_PROTECTION (U6.1)
C1_N: C1 (R35_C1.1 U2_C1.6), CONNECTORS (P1.3)
C1_P: C1 (R35_C1.2 U2_C1.7), CONNECTORS (P1.2)
C2_N: C2 (R35_C2.1 U2_C2.6), CONNECTORS (P2.3)
C2_P: C2 (R35_C2.2 U2_C2.7), CONNECTORS (P2.2)
C3_N: C3 (R35_C3.1 U2_C3.6), CONNECTORS (P3.3)
C3_P: C3 (R35_C3.2 U2_C3.7), CONNECTORS (P3.2)
NetD3_2: MCU (U1.46), LEDS (D3.2)
NetD4_2: MCU (U1.137), LEDS (D4.2)
NetD5_2: MCU (U1.75), LEDS (D5.2)
NetD6_2: ETHERNET (U4.3), LEDS (D6.2), CONNECTORS (J3.9)
NetD7_2: ETHERNET (R31.1 U4.2), LEDS (D7.2), CONNECTORS (J3.11)
NetJ2_3: MCU (U1.116), SD_CARD (J2.3 R9.1), ESD_PROTECTION (U6.10)
NetJ2_5: MCU (U1.113), SD_CARD (J2.5), ESD_PROTECTION (U6.7)
NetJ2_9: MCU (U1.87), SD_CARD (J2.9), ESD_PROTECTION (U6.2)
NetP5_1: MCU (U1.59), CONNECTORS (P5.1)
NetP5_2: MCU (U1.58), CONNECTORS (P5.2)
NetP5_3: MCU (U1.96), CONNECTORS (P5.3)
NetP5_4: MCU (U1.97), CONNECTORS (P5.4)
NetP6_5: MCU (P6.5 R32.2 U1.25), ETHERNET (U4.15)
NetR14_2: MCU (U1.44), ETHERNET (R14.2)
NetR15_2: MCU (U1.45), ETHERNET (R15.2)
NetR19_2: MCU (U1.43), ETHERNET (R19.2)
NetR20_1: MCU (U1.35), ETHERNET (R20.1)
NetR22_2: MCU (U1.36), ETHERNET (R22.2 U4.12)
NetU1_27: MCU (U1.27), ETHERNET (U4.13)
NetU1_74: MCU (U1.74), ETHERNET (U4.18)
NetU1_100: MCU (U1.100), C3 (U2_C3.1)
NetU1_110: MCU (U1.110), C3 (U2_C3.4)
NetU1_126: MCU (U1.126), ETHERNET (U4.16)
NetU1_128: MCU (U1.128), ETHERNET (U4.17)
NetU1_135: MCU (U1.135), C2 (U2_C2.4)
NetU1_136: MCU (U1.136), C2 (U2_C2.1)
NetU1_139: MCU (U1.139), C1 (U2_C1.4)
NetU1_140: MCU (U1.140), C1 (U2_C1.1)
RX_N: ETHERNET (U5.9), CONNECTORS (J3.6 P4.4)
RX_P: ETHERNET (U5.11), CONNECTORS (J3.3 P4.3)
RX_PHYS_N: ETHERNET (R30.2 U4.22 U5.8), ESD_PROTECTION (U6.14)
RX_PHYS_P: ETHERNET (R29.2 U4.23 U5.6), ESD_PROTECTION (U6.13)
SD_D0: MCU (U1.98), SD_CARD (J2.7 R10.1), ESD_PROTECTION (U6.3)
SD_D1: MCU (U1.99), SD_CARD (J2.8 R11.1), ESD_PROTECTION (U6.4)
SD_D2: MCU (U1.111), SD_CARD (J2.1 R12.1), ESD_PROTECTION (U6.5)
SD_D3: MCU (U1.112), SD_CARD (J2.2 R13.1), ESD_PROTECTION (U6.6)
TX_N: ETHERNET (U5.14), CONNECTORS (J3.2 P4.2)
TX_P: ETHERNET (U5.16), CONNECTORS (J3.1 P4.1)
TX_PHYS_N: ETHERNET (R28.2 U4.20 U5.3), ESD_PROTECTION (U6.12)
TX_PHYS_P: ETHERNET (R27.2 U4.21 U5.1), ESD_PROTECTION (U6.11)